# EAGLE design owc-transmitter-ir-v2 (EAGLE 8.6.0)

## Sheet 1 of 3
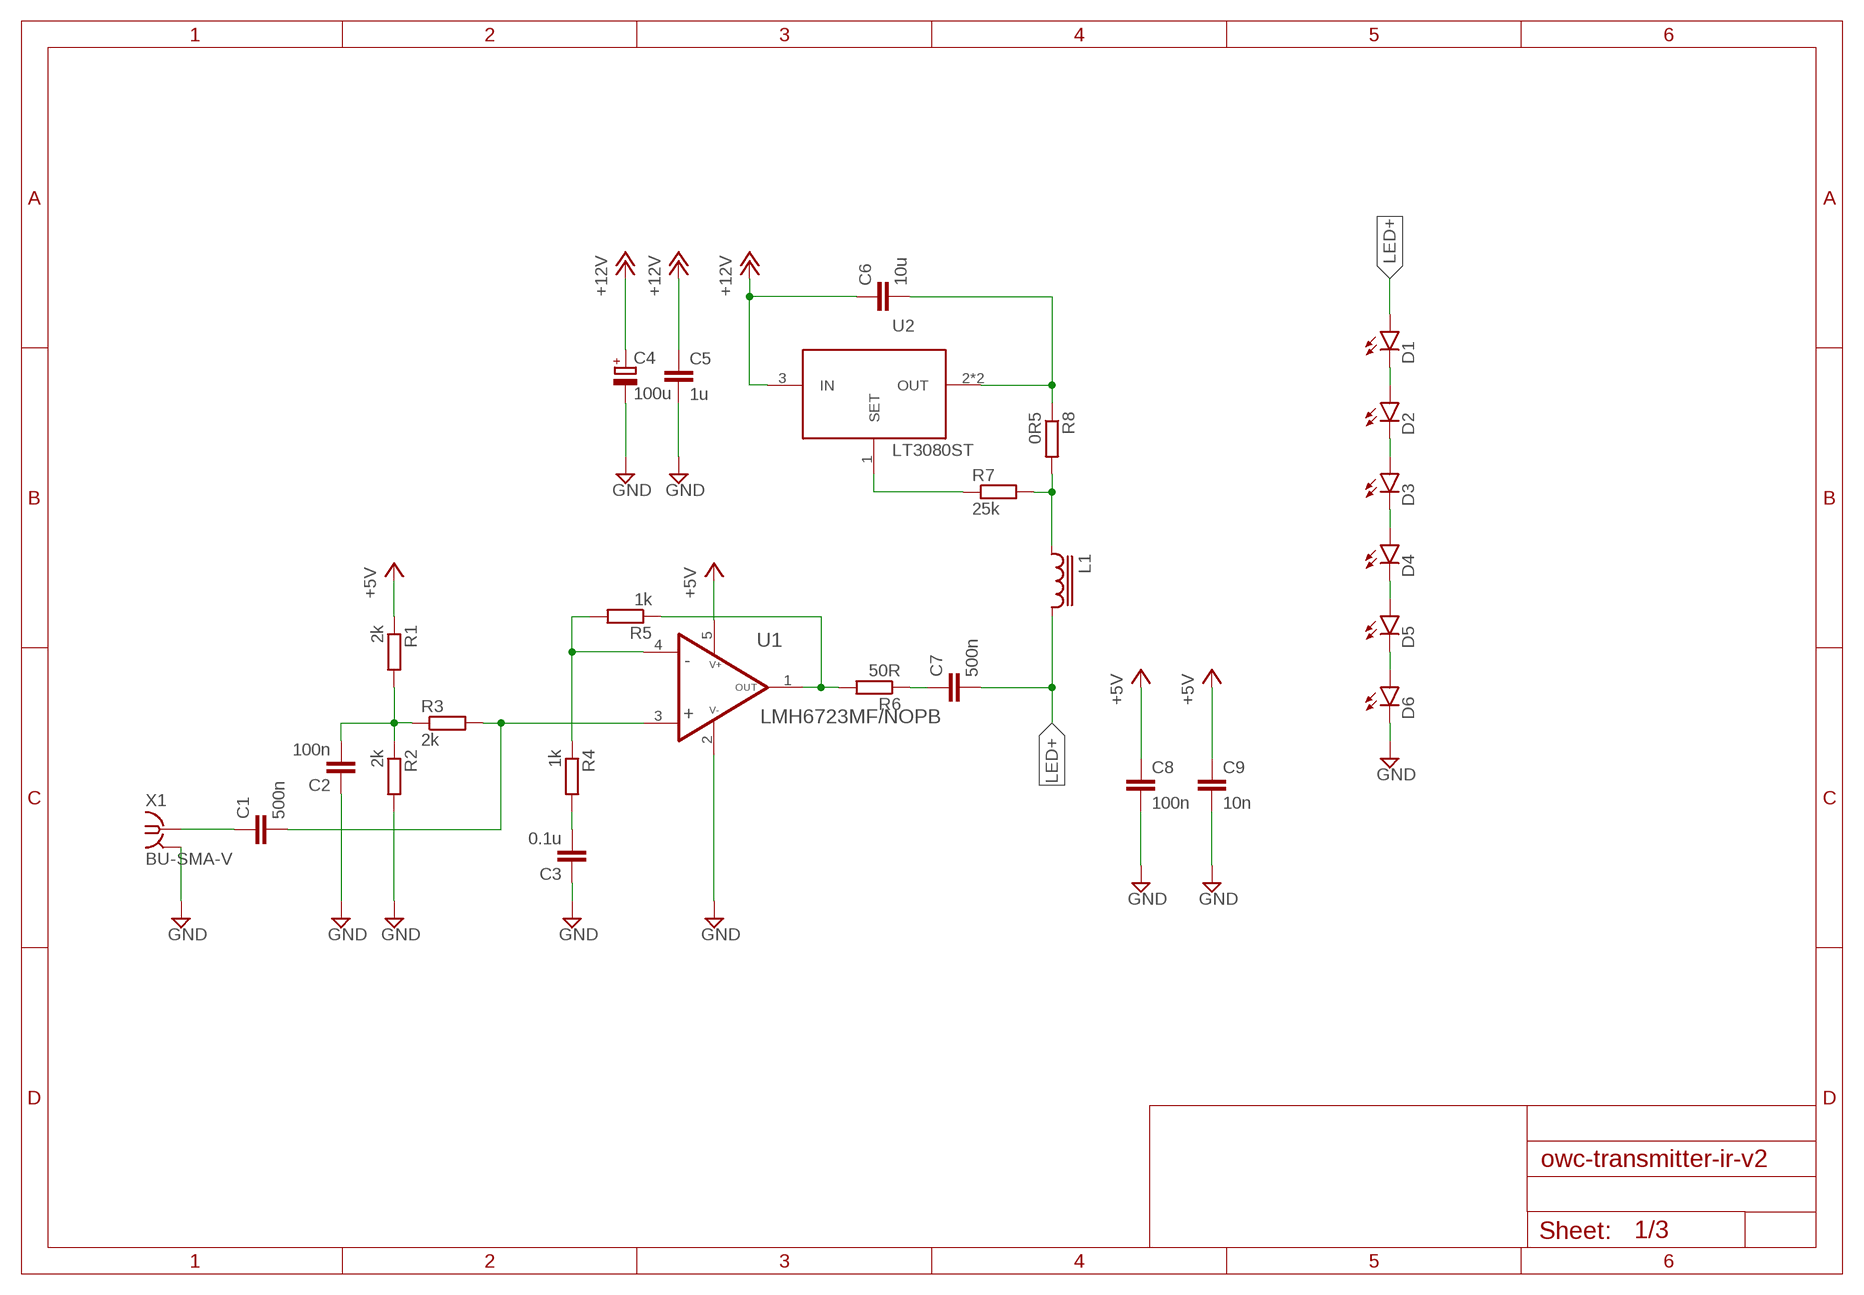
[diagram p0: schematic, sheet 1]

### Parts
C1  500n  C-EUC0805  [C0805]
C2  100n  C-EUC0805  [C0805]
C3  0.1u  C-EUC0805  [C0805]
C4  100u  CPOL-EUCT3528  [CT3528]
C5  1u  C-EUC0805  [C0805]
C6  10u  C-EUC0805  [C0805]
C7  500n  C-EUC0805  [C0805]
C8  100n  C-EUC0805  [C0805]
C9  10n  C-EUC0805  [C0805]
D1  LED5MM  [LED5MM]
D2  LED5MM  [LED5MM]
D3  LED5MM  [LED5MM]
D4  LED5MM  [LED5MM]
D5  LED5MM  [LED5MM]
D6  LED5MM  [LED5MM]
L1  SRR6603  [SRR6603]
R1  2k  R-EU_R0805  [R0805]
R2  2k  R-EU_R0805  [R0805]
R3  2k  R-EU_R0805  [R0805]
R4  1k  R-EU_R0805  [R0805]
R5  1k  R-EU_R0805  [R0805]
R6  50R  R-EU_R0805  [R0805]
R7  25k  R-EU_R0805  [R0805]
R8  0R5  R-EU_R0805  [R0805]
U1  LMH6723MF/NOPB  [SOT23-5L]
U2  LT3080ST  [SOT223]
X1  BU-SMA-V  [BU-SMA-V]

### Nets
+5V: C8.1 C9.1 R1.1 U1.5(V+) ; also sheet 3
+12V: C4.+ C5.1 C6.1 U2.3(IN) ; also sheet 3
GND: C2.1 C3.1 C4.- C5.2 C8.2 C9.2 D6.K(C) R2.2 U1.2(V-) X1.2 X1.3 X1.4 X1.5 ; also sheet 2,3
LED+: C7.2 D1.A L1.P$2
N$1: D1.K(C) D2.A
N$2: D2.K(C) D3.A
N$3: D3.K(C) D4.A
N$4: D4.K(C) D5.A
N$5: D5.K(C) D6.A
N$6: R5.1 R6.2 U1.1(OUT)
N$7: C7.1 R6.1
N$8: R4.1 R5.2 U1.4(IN-)
N$9: C6.2 R8.1 U2.2(OUT) U2.4(OUT)
N$10: C3.2 R4.2
N$11: L1.P$1 R7.2 R8.2
N$12: C2.2 R1.2 R2.1 R3.1
N$13: C1.1 X1.1
N$14: R7.1 U2.1(SET)
N$15: C1.2 R3.2 U1.3(IN+)

## Sheet 2 of 3
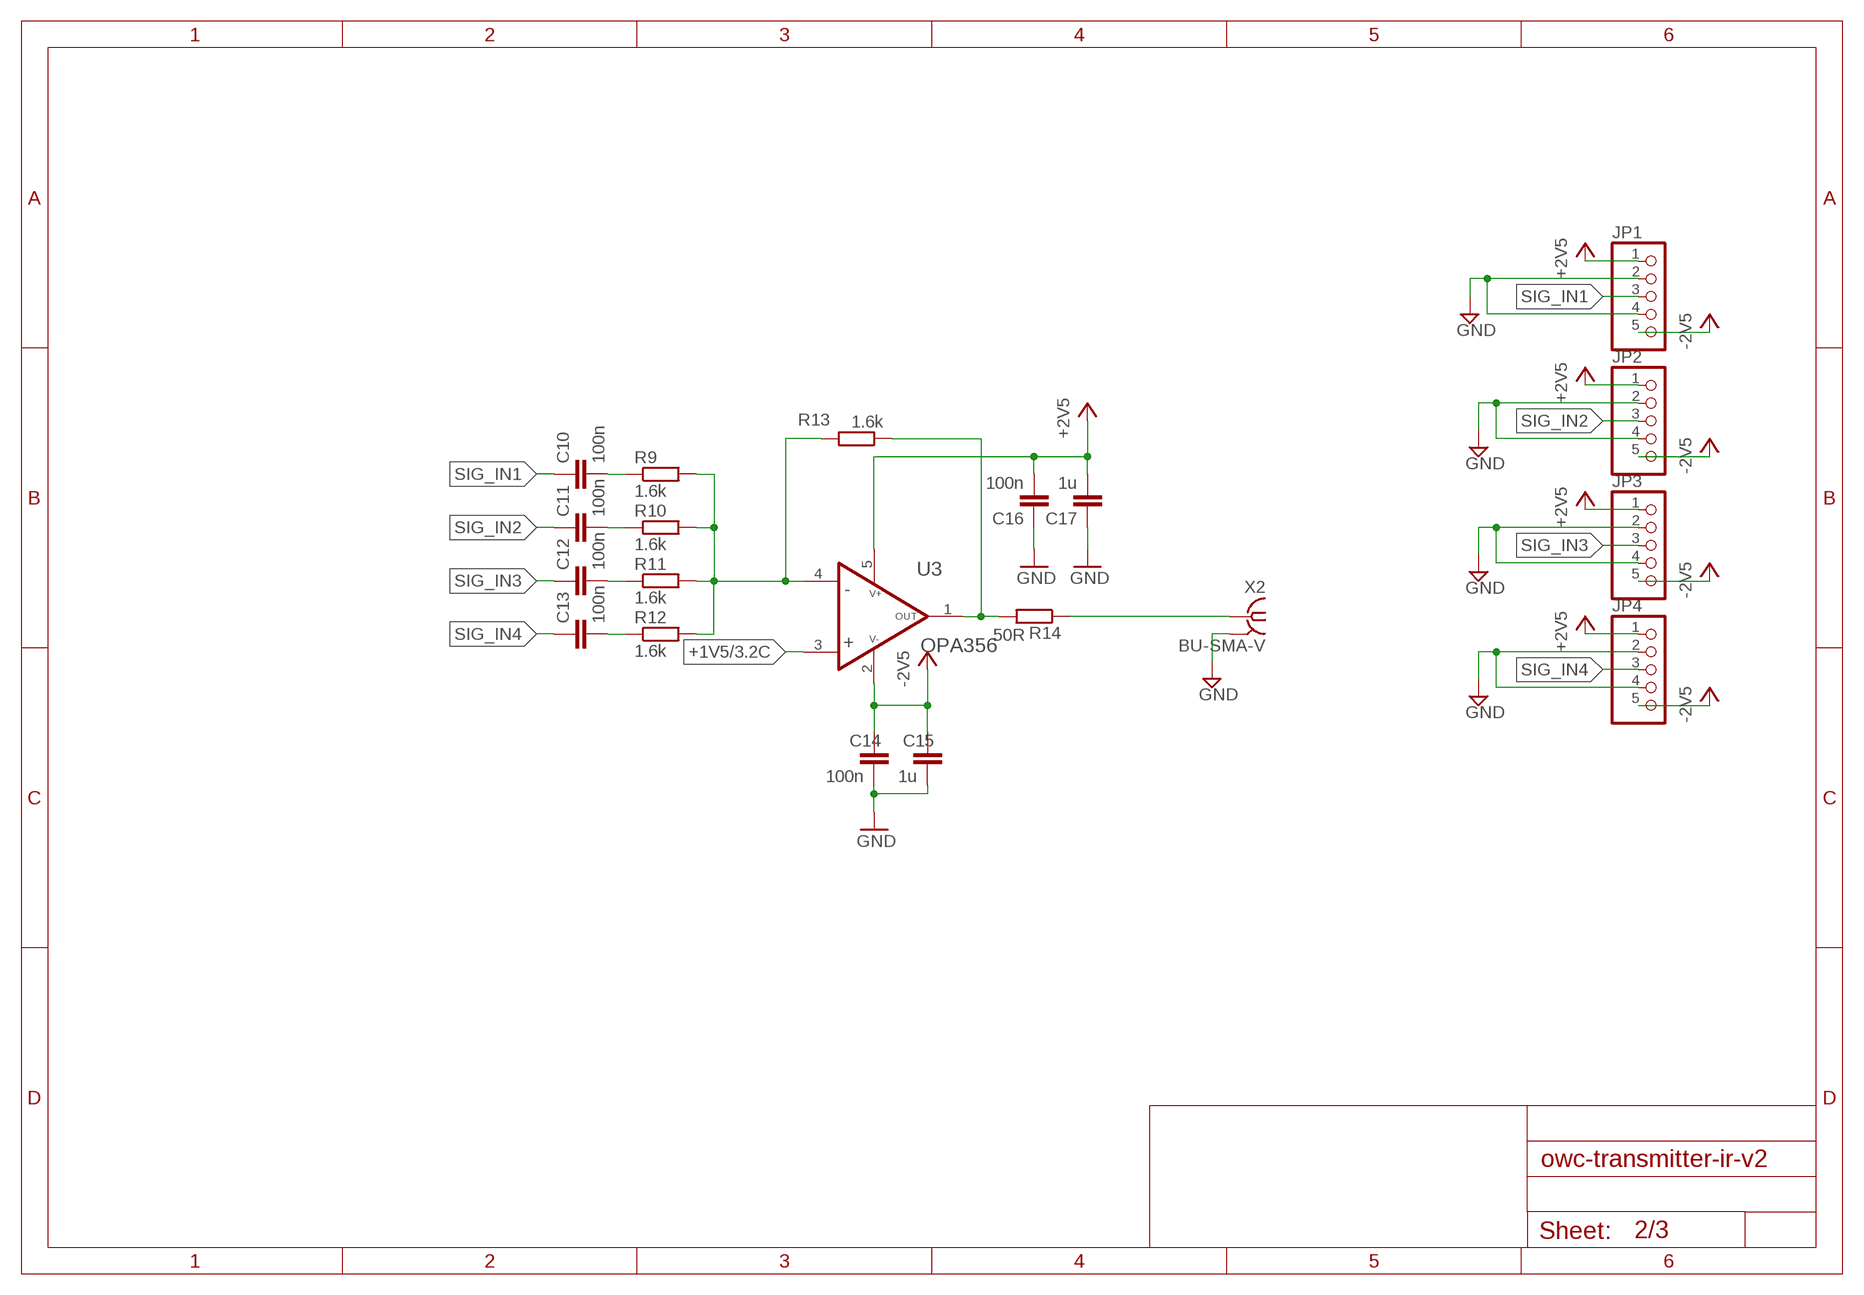
[diagram p1: schematic, sheet 2]

### Parts
C10  100n  C-EUC0805  [C0805]
C11  100n  C-EUC0805  [C0805]
C12  100n  C-EUC0805  [C0805]
C13  100n  C-EUC0805  [C0805]
C14  100n  C-EUC0805  [C0805]
C15  1u  C-EUC0805  [C0805]
C16  100n  C-EUC0805  [C0805]
C17  1u  C-EUC0805  [C0805]
JP1  PINHD-1X5  [1X05]
JP2  PINHD-1X5  [1X05]
JP3  PINHD-1X5  [1X05]
JP4  PINHD-1X5  [1X05]
R9  1.6k  R-EU_R0805  [R0805]
R10  1.6k  R-EU_R0805  [R0805]
R11  1.6k  R-EU_R0805  [R0805]
R12  1.6k  R-EU_R0805  [R0805]
R13  1.6k  R-EU_R0805  [R0805]
R14  50R  R-EU_R0805  [R0805]
U3  OPA356  LMH6629MF  [SOT23-5L]
X2  BU-SMA-V  [BU-SMA-V]

### Nets
+1V5: U3.3(IN+) ; also sheet 3
+2V5: C16.2 C17.2 JP1.1 JP2.1 JP3.1 JP4.1 U3.5(V+) ; also sheet 3
-2V5: C14.1 C15.1 JP1.5 JP2.5 JP3.5 JP4.5 U3.2(V-) ; also sheet 3
GND: C14.2 C15.2 C16.1 C17.1 JP1.2 JP1.4 JP2.2 JP2.4 JP3.2 JP3.4 JP4.2 JP4.4 X2.2 X2.3 X2.4 X2.5 ; also sheet 1,3
N$16: R13.1 R14.2 U3.1(OUT)
N$18: C12.2 R11.1
N$19: R9.2 R10.2 R11.2 R12.2 R13.2 U3.4(IN-)
N$20: R14.1 X2.1
N$22: C11.2 R10.1
N$24: C13.2 R12.1
N$26: C10.2 R9.1
SIG_IN1: C10.1 JP1.3
SIG_IN2: C11.1 JP2.3
SIG_IN3: C12.1 JP3.3
SIG_IN4: C13.1 JP4.3

## Sheet 3 of 3
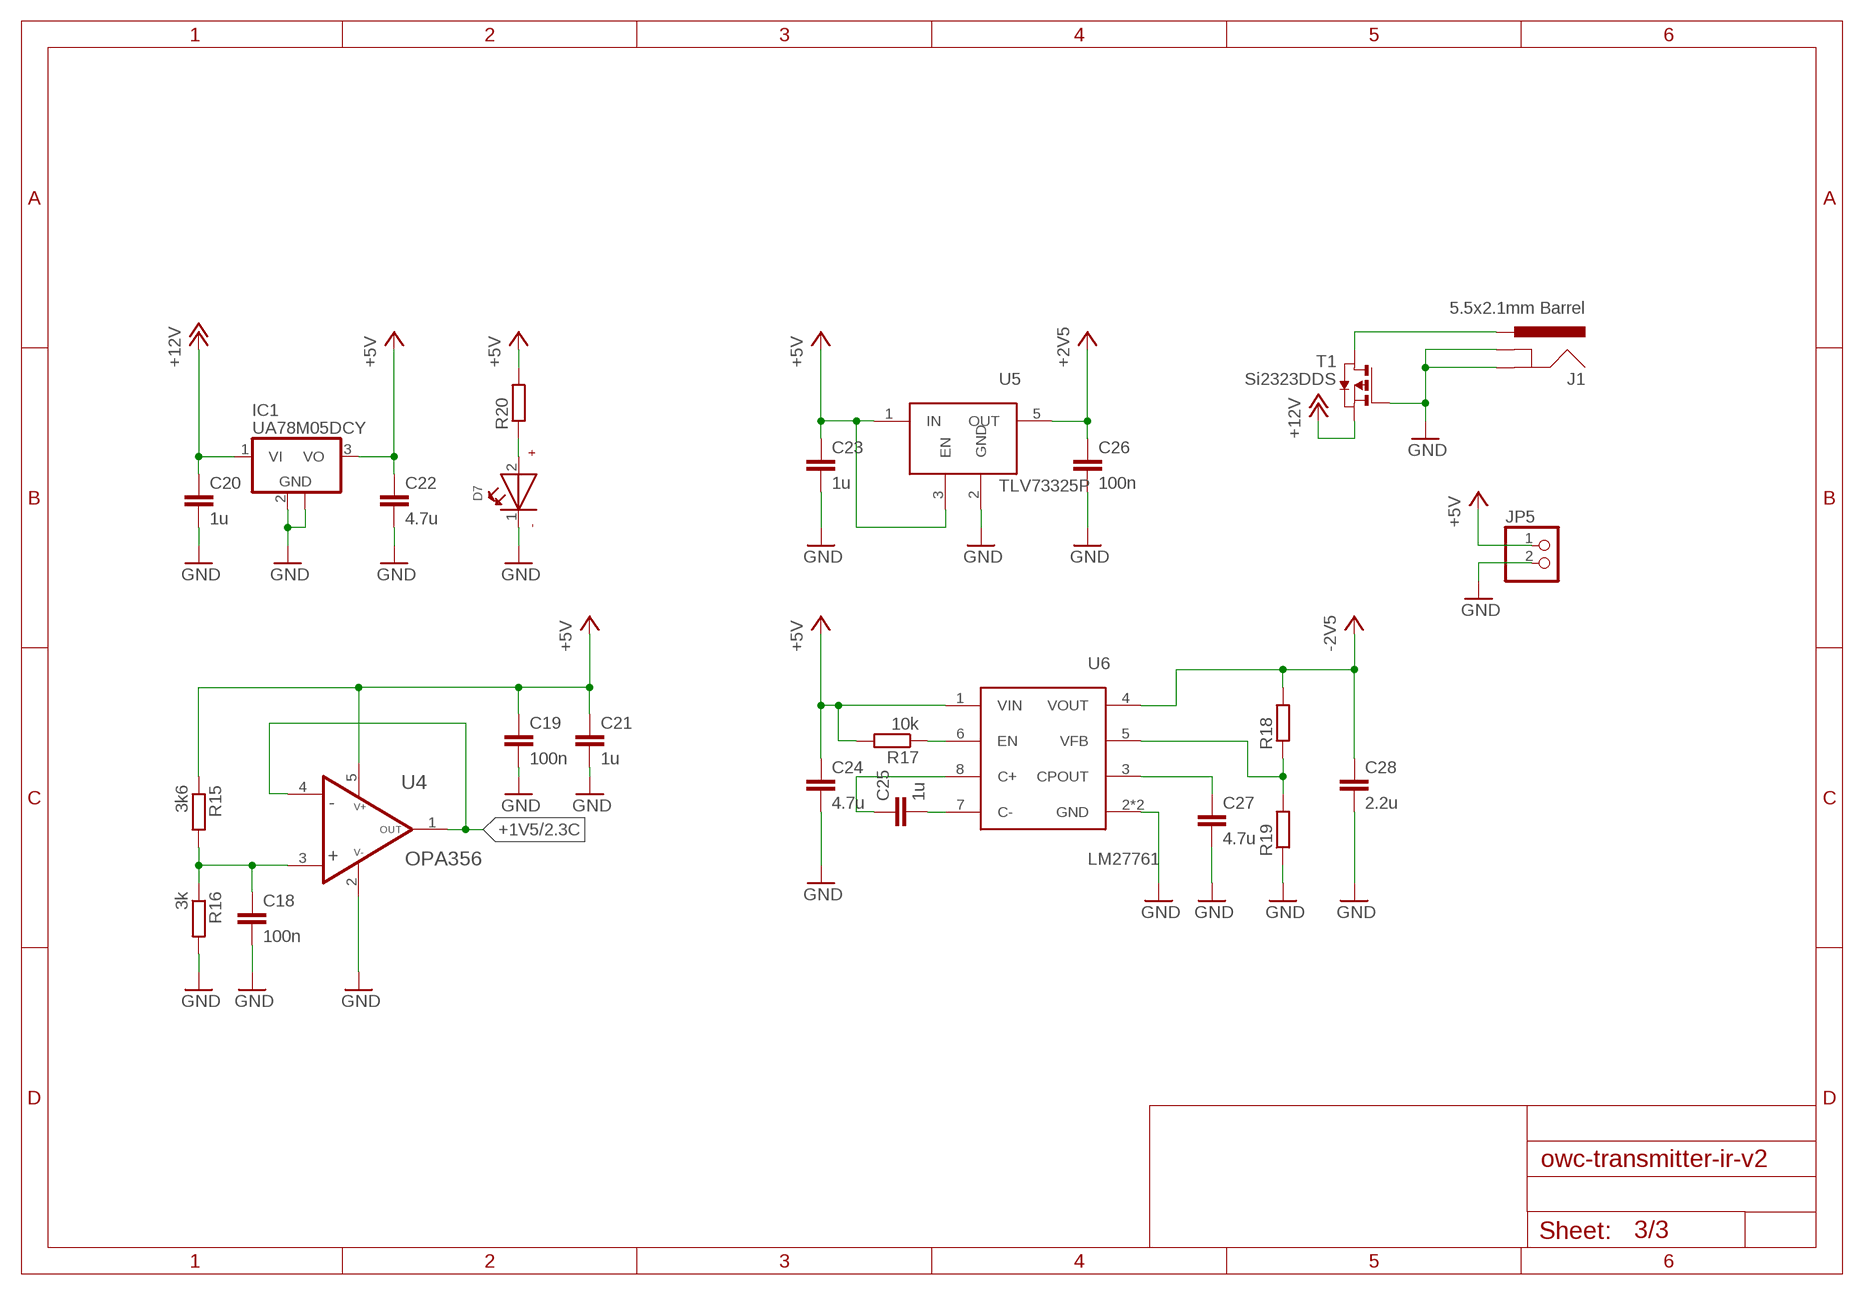
[diagram p2: schematic, sheet 3]

### Parts
C18  100n  C-EUC0805  [C0805]
C19  100n  C-EUC0805  [C0805]
C20  1u  C-EUC0805  [C0805]
C21  1u  C-EUC0805  [C0805]
C22  4.7u  C-EUC0805  [C0805]
C23  1u  C-EUC0805  [C0805]
C24  4.7u  C-EUC0805  [C0805]
C25  1u  C-EUC0805  [C0805]
C26  100n  C-EUC0805  [C0805]
C27  4.7u  C-EUC0805  [C0805]
C28  2.2u  C-EUC0805  [C0805]
D7  WL-SMCW-150080GS75000-G  [WL-SMCW_0805]
IC1  UA78M05DCY  [SOT223]
J1  5.5x2.1mm Barrel  POWER_JACKSMD  [POWER_JACK_SMD]
JP5  PINHD-1X2  [1X02]
R15  3k6  R-EU_R0805  [R0805]
R16  3k  R-EU_R0805  [R0805]
R17  10k  R-EU_R0805  [R0805]
R18  R-EU_R0805  [R0805]
R19  R-EU_R0805  [R0805]
R20  R-EU_R0805  [R0805]
T1  Si2323DDS  PMOSSOT23  [SOT-23]
U4  OPA356  LMH6629MF  [SOT23-5L]
U5  TLV73325P  V_REG5-FIXEDEN  [SOT23-5L]
U6  LM27761DSG  [WSON-8-PAD]

### Nets
+1V5: U4.1(OUT) U4.4(IN-) ; also sheet 2
+2V5: C26.1 U5.5(OUT) ; also sheet 2
+5V: C19.1 C21.1 C22.1 C23.1 C24.1 IC1.3(VO) JP5.1 R15.1 R17.2 R20.2 U4.5(V+) U5.1(IN) U5.3(EN) U6.1(VIN) ; also sheet 1
+12V: C20.1 IC1.1(VI) T1.2(S) ; also sheet 1
-2V5: C28.1 R18.2 U6.4(VOUT) ; also sheet 2
GND: C18.2 C19.2 C20.2 C21.2 C22.2 C23.2 C24.2 C26.2 C27.2 C28.2 D7.1(-) IC1.2(GND) IC1.4(GND) J1.GND(GNDBREAK) J1.P$4(GND) JP5.2 R16.2 R19.1 T1.3(G) U4.2(V-) U5.2(GND) U6.2(GND) U6.PAD(GND) ; also sheet 1,2
N$17: C27.1 U6.3(CPOUT)
N$21: C25.1 U6.8(C+)
N$23: C25.2 U6.7(C-)
N$25: D7.2(+) R20.1
N$27: R17.1 U6.6(EN)
N$28: R18.1 R19.2 U6.5(VFB)
N$29: C18.1 R15.2 R16.1 U4.3(IN+)
N$30: J1.VIN0(PWR) T1.1(D)

## Library data of the parts
C1-C3 C5-C28 = resistor:C-EU: CAPACITOR, European symbol
C4 = rcl:CPOL-EU: POLARIZED CAPACITOR, European symbol; SPICEPREFIX: C
D1-D6 = misc-parts:LED: LEDs Standard schematic elements and footprints for 5mm, 3mm, 1206, and 0603 sized LEDs. 5mm - Spark Fun Electronics SKU : COM-00529 (and others)
D7 = Wurth_Elektronik_Optoelectronics_rev17b:WL-SMCW: SMD mono-color Chip LED Characteristics Low energy consumption High reliability Low current requirement Fast switching No UV/IR radiation Smallest SMD package with exceptional brightness Top view Wide viewing angle PBC high-usage Applications Backlight for mobile and portable device keypads Indoor and outdoor message boards Flat backlight for LCDs, switches and symbols Display for industrial control systems and traffic Miniaturized color effects Pedestrian mark Optical indicators General lighting Toys <http://katalog.we-online.de/media/images/eipal/WL-SMCW_pf2.jpg> Details see: http://katalog.we-online.de/en/led/WL-SMCW?m Updated 2015-04-10 2015 (C) Wurth Elektronik
IC1 = linear:UA78M*: POSITIVE-VOLTAGE REGULATORS Source: http://focus.ti.com/lit/ds/symlink/ua78m33.pdf
J1 = SparkFun-Connectors:POWER_JACK: Power Jack This is the standard 5.5mm barrel jack for power. The PTH is the most common, proven, reliable, footprint. The Slot footprint only works if the mill layer is transmitted to the PCB fab house so be warned. Mating wall wart : TOL-00298 (and others); PROD_ID: CONN-08106; SF_ID: PRT-12748
JP1-JP4 = pinhead+:PINHD-1X5: PIN HEADER
JP5 = pinhead+:PINHD-1X2: PIN HEADER
L1 = misc-parts:SRR6603
R1-R20 = resistor:R-EU_: RESISTOR, European symbol
T1 = zetex:PMOSSOT23: MOS FET; OC_FARNELL: unknown; OC_NEWARK: unknown
U1 = misc-parts:LMH6723
U2 = misc-parts:LT3080
U3 U4 = misc-parts:LMH6629
U5 = misc-parts:V_REG5-FIXED
U6 = misc-parts:LM27761; MPN: LM27761DSGT
X1 X2 = con-coax:BU-SMA-V: FEMALE SMA CONNECTOR Radiall distributor RS 112-3794; OC_FARNELL: unknown; OC_NEWARK: unknown

## Board
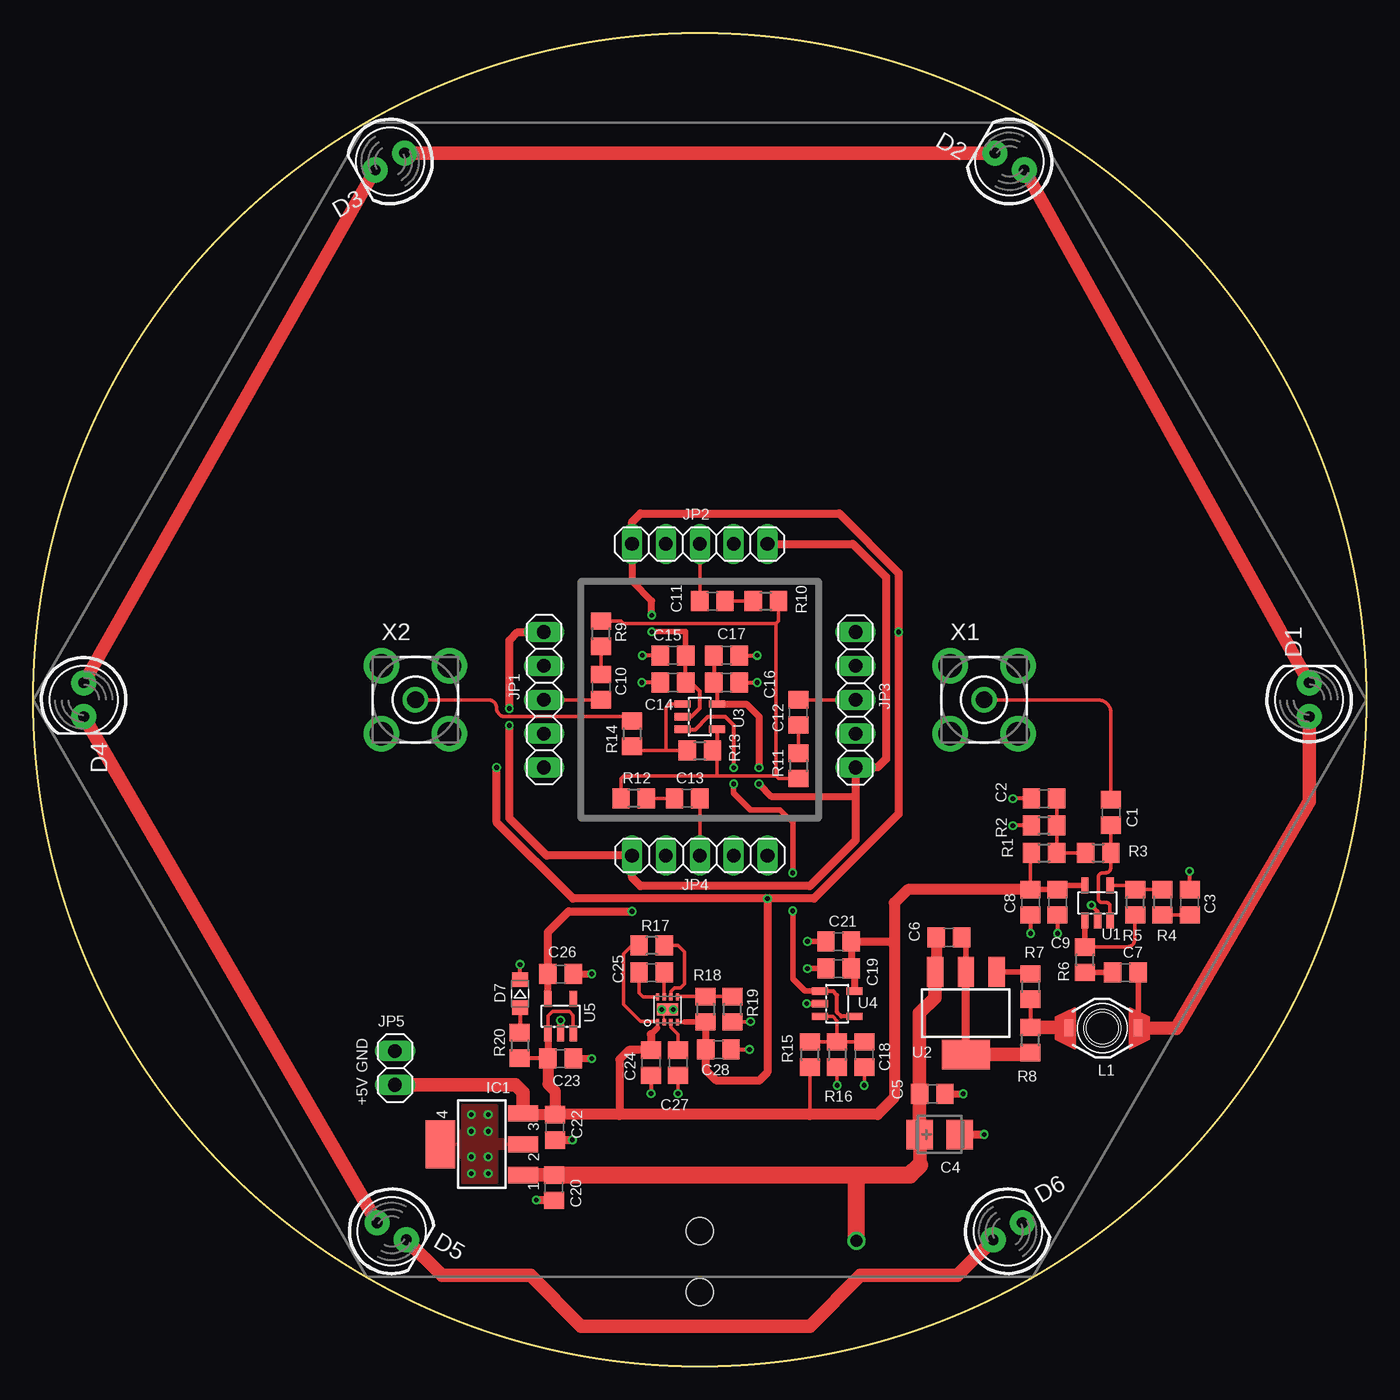
[diagram p3: board, top side]
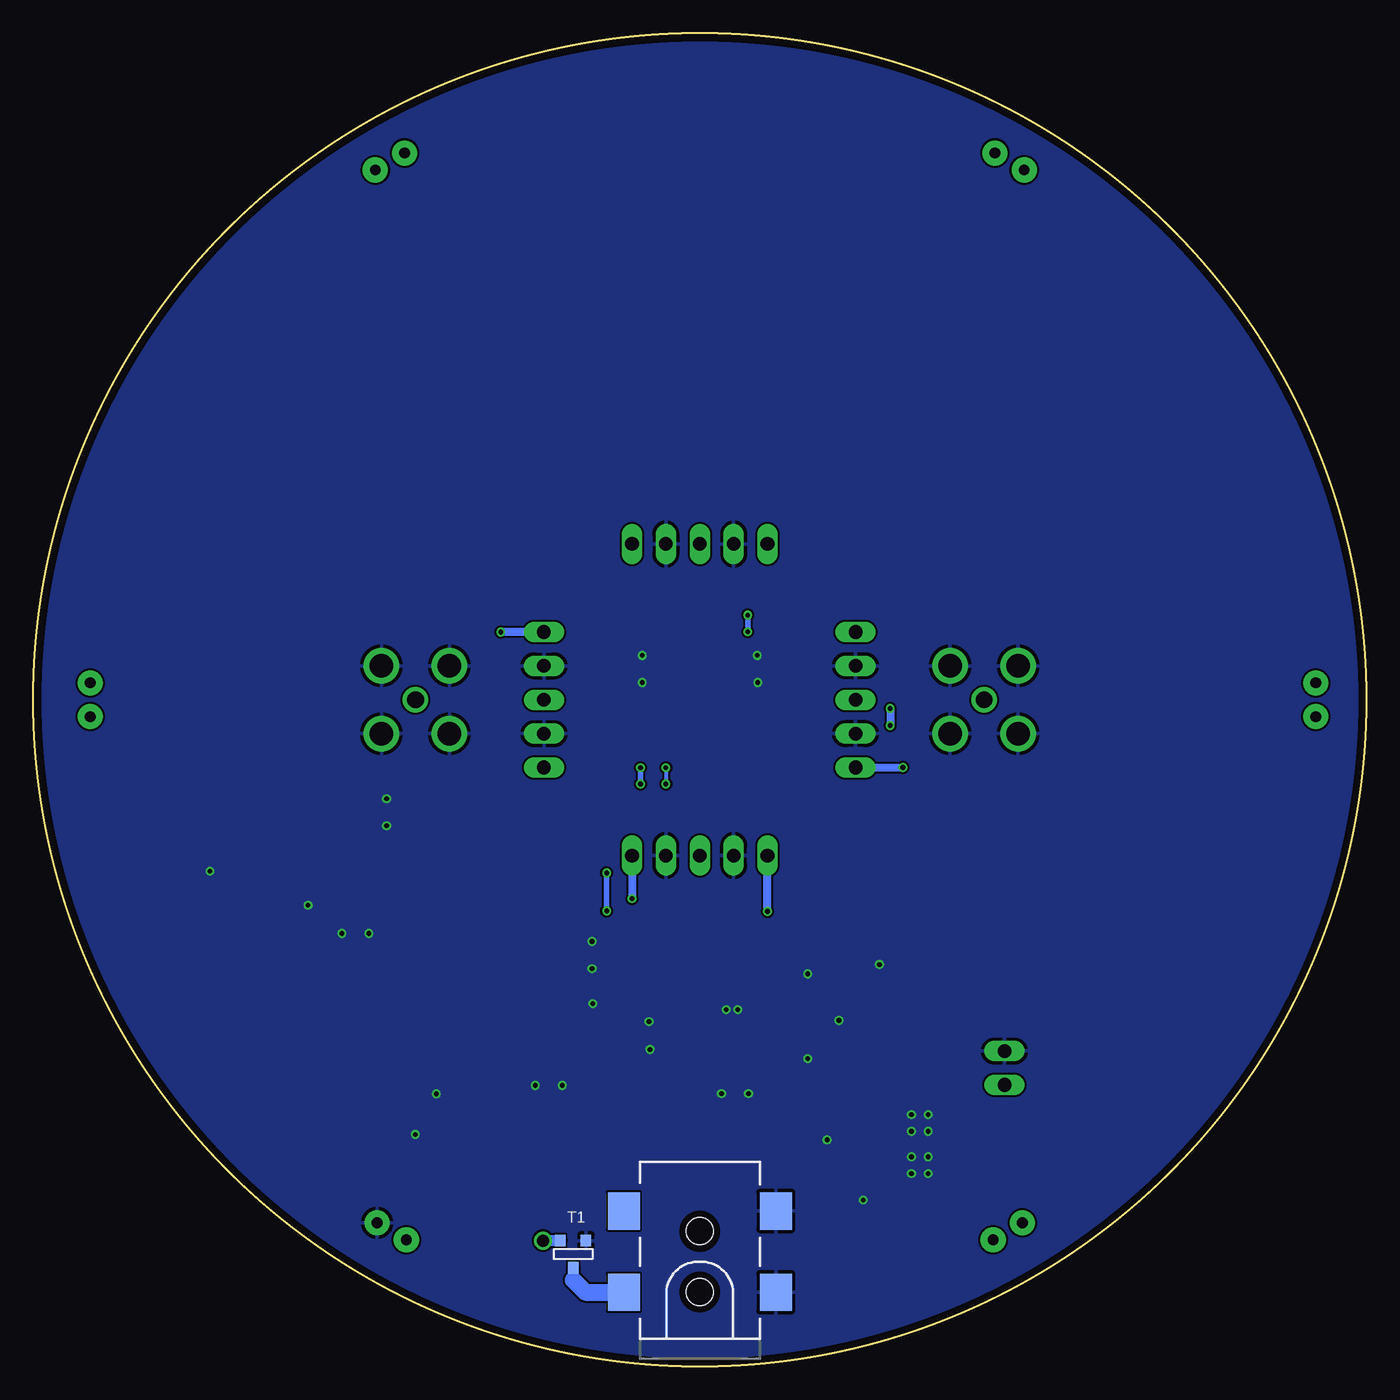
[diagram p4: board, bottom side, seen from below]

Size 100 x 100 mm. Coordinates in mm from the lower left corner, seen from the top.
Outline: circle at 50,50 radius 50
Copper layers (1*16): Top 0.035mm / dielectric 1.6mm / Bottom 0.035mm
Design rules "Elecrow-2-layer_PCB_eagle_rule *": minimum track width 6mil, minimum drill 12mil, track to track 6mil, track to pad 8mil, pad to pad 8mil, via to via 12mil, smd to smd 0mil, copper to edge 20mil, drill to drill 10mil, minimum pad ring 6mil, minimum via ring 6mil, stop-mask expansion 0.2mm, vias tented up to drill 100mil, thermal gap 10mil

### Footprints (pad centres in the part's own frame; a part is rotated, then mirrored left to right if it is on the bottom)
C0805 = smd 1.3 x 1.5: 1 -0.95,0; 2 0.95,0
CT3528 = smd 2 x 2.2: + -1.5,0; - 1.5,0
LED5MM = drill 0.813 pad 1.88: A -1.27,0; K 1.27,0
WL-SMCW_0805 = smd 1.1 x 1.2: 1 -1.05,0; 2 1.05,0
SOT223 = smd 1.219 x 2.235: 1 -2.311,-3.099; 2 0,-3.099; 3 2.311,-3.099 | smd 3.6 x 2.2: 4 0,3.099
POWER_JACK_SMD = smd 2.8 x 2.4: GND 0,-5.7; P$4 6.1,-5.7; VIN0 0,5.7; VIN1 6.1,5.7 | hole 2.032: 0,0; 4.572,0
1X05 = drill 1.016 long: 1 -5.08,0; 2 -2.54,0; 3 0,0; 4 2.54,0; 5 5.08,0
1X02 = drill 1.016 long: 1 -1.27,0; 2 1.27,0
SRR6603 = smd 0.635 x 1.27: P$1 -2.515,0.04; P$2 2.7,0.01
R0805 = smd 1.3 x 1.5: 1 -0.95,0; 2 0.95,0
SOT-23 = smd 0.787 x 0.889: 1 0.025,-1.016; 2 -0.94,1.016; 3 0.991,1.016
SOT23-5L = smd 0.55 x 1.2: 1 -0.95,-1.3; 2 0,-1.3; 3 0.95,-1.3; 4 0.95,1.3; 5 -0.95,1.3
WSON-8-PAD = smd 0.25 x 0.5: 1 -0.75,-0.95; 2 -0.25,-0.95; 3 0.25,-0.95; 4 0.75,-0.95; 5 0.75,0.95; 6 0.25,0.95; 7 -0.25,0.95; 8 -0.75,0.95 | smd 1.6 x 0.9: PAD 0,0
BU-SMA-V = drill 1.27: 1 0,0 | drill 1.778: 2 -2.55,2.55; 3 2.55,2.55; 4 2.55,-2.55; 5 -2.55,-2.55

### Placement (x,y rotation side)
C1  80.86,41.54 270 top
C2  75.83,42.58 0 top
C3  86.75,34.81 270 top
C4  68.01,17.39 0 top
C5  67.45,20.43 0 top
C6  68.69,32.17 0 top
C7  81.93,29.53 0 top
C8  74.82,34.81 270 top
C9  76.85,34.81 270 top
C10  42.61,50.94 90 top
C11  50.94,57.39 0 top
C12  57.39,49.06 270 top
C13  49.06,42.61 180 top
C14  47.99,51.3 180 top
C15  47.99,53.33 180 top
C16  52.01,51.3 180 top
C17  52.01,53.33 180 top
C18  62.34,23.38 270 top
C19  60.41,29.83 180 top
C20  39.05,13.4 270 top
C21  60.41,31.86 180 top
C22  39.13,17.92 270 top
C23  39.56,23.08 0 top
C24  46.34,22.77 270 top
C25  46.39,29.53 0 top
C26  39.56,29.43 0 top
C27  48.37,22.77 270 top
C28  51.4,23.76 0 top
D1  95.72,50 90 top
D2  73.24,90.39 150 top
D3  26.76,90.39 210 top
D4  3.77,50 270 top
D5  26.89,10.12 330 top
D6  73.11,10.12 30 top
D7  36.51,27.94 270 top
IC1  33.64,16.65 90 top
J1  50,5.55 90 bottom
JP1  38.32,50 270 top
JP2  50,61.68 180 top
JP3  61.68,50 90 top
JP4  50,38.32 0 top
JP5  27.14,22.38 90 top
L1  80.2,25.36 0 top
R1  75.83,38.52 0 top
R2  75.83,40.55 180 top
R3  79.9,38.52 0 top
R4  84.72,34.81 270 top
R5  82.69,34.81 90 top
R6  78.91,30.49 90 top
R7  74.82,28.49 270 top
R8  74.82,24.47 90 top
R9  42.61,54.95 90 top
R10  54.95,57.39 0 top
R11  57.39,45.05 270 top
R12  45.05,42.61 180 top
R13  50,46.19 0 top
R14  44.92,47.46 270 top
R15  58.28,23.38 90 top
R16  60.31,23.38 270 top
R17  46.39,31.56 180 top
R18  50.43,26.78 270 top
R19  52.46,26.78 90 top
R20  36.5,24.07 270 top
T1  59.52,8.41 0 bottom
U1  79.84,34.76 0 top
U2  69.96,26.48 180 top
U3  50,48.73 270 top
U4  60.31,27.19 270 top
U5  39.56,26.25 0 top
U6  47.59,26.76 0 top
X1  71.34,50 0 top
X2  28.66,50 0 top

### Tracks (layer width: path | path; a pad name or v marks a point on that pad's centre or on a via)
+1V5  (via drill 0.35)
  Top 0.305: U3.3 49.69,47.78 50.63,48.73 51.91,48.73 52.54,48.09 v52.54,44.89 | U4.1 60,28.14 60.31,27.83 60.31,26.56 60.63,26.24 U4.4
  Top 0.406: v52.54,43.67 52.54,43.02 53.81,41.74 56.03,41.74 56.98,40.79 v56.98,37.01 | U4.1 57.89,28.14 56.98,29.05 v56.98,34.15
  Bottom 0.305: v52.54,44.89 v52.54,43.67
  Bottom 0.406: v56.98,34.15 v56.98,37.01
+2V5  (via drill 0.35)
  Top 0.305: C17.2 C16.2 51.3,51.05 U3.5
  Top 0.508: U5.5 C26.1 | U3.5 53.49,49.68 54.45,48.73 v54.45,44.89 | v54.45,43.67 55.36,42.76 61.62,42.76 61.68,42.7
  Top 0.61: JP2.1 61.49,61.68 63.97,59.21 63.97,45.55 63.34,44.92 JP3.1 61.68,42.7 61.68,39.46 58.26,36.03 45.55,36.03 44.92,36.66 JP4.1 38.51,38.32 35.71,41.11 v35.71,48.07 | v35.71,49.34 35.71,54.45 36.35,55.08 JP1.1 | C26.1 38.61,32.58 40.16,34.12 v44.92,34.12
  Bottom 0.406: v54.45,44.89 v54.45,43.67
  Bottom 0.61: v35.71,49.34 v35.71,48.07 | v44.92,34.12 JP4.1
+5V
  Top 0.203: 46.82,25.79 U6.1
  Top 0.254: R1.1 74.89,38.51 arc90 74.82,38.43 C8.1 | U6.1 46.84,25.58 | U6.1 46.84,25.4 | 58.26,22.41 58.26,18.89 | U6.1 46.78,25.87 45.55,25.87 44.28,27.14 44.28,30.95 44.92,31.59 44.95,31.56 R17.2 | U5.1 38.61,26.27 38.95,26.61 40.22,26.61 40.5,26.33 U5.3
  Top 0.305: 76.85,36.06 C9.1 | C23.1 36.54,23.08
  Top 0.406: C8.1 C9.1 | U1.5 76.85,36.06 | 46.84,25.4 46.34,24.91 | 36.54,23.08 R20.2
  Top 0.508: R1.1 74.83,38.57 | U5.1 38.62,24.95 38.62,23.08 | C21.1 C19.1 | 61.61,29.58 U4.5
  Top 0.61: 46.34,24.91 C24.1 44.68,23.72 43.97,23.01 43.97,18.89 | C23.1 38.62,23.08 | C19.1 61.61,29.58 | C21.1 64.33,31.86 64.61,31.59
  Top 0.813: 39.14,18.89 43.97,18.89 58.26,18.89 63.34,18.89 64.61,20.16 64.61,31.59 64.61,34.76 65.61,35.76 C8.1 | R15.1 58.26,22.41 | 39.14,18.89 C22.1 36.83,18.87 | C23.1 38.61,21.16 39.14,20.62 39.14,18.89
  Top 1.016: JP5.1 36.17,21.11 36.74,20.54 IC1.3 36.83,18.87
+12V  (via drill 0.9)
  Top 0.61: 67.74,29.67 U2.3
  Top 0.813: C6.1 67.74,29.67
  Top 1.016: U2.3 67.65,27.65 66.5,26.5 C5.1 C4.+ 66.51,15.08 | IC1.1 39.04,14.34 C20.1 | v61.76,9.42 61.75,9.44
  Top 1.27: C20.1 61.75,14.35 | 61.75,14.35 65.78,14.35 66.51,15.08 | 61.75,9.44 61.75,14.35
  Bottom 0.813: T1.2 v61.76,9.42
-2V5  (via drill 0.35)
  Top 0.254: 50.41,25.81 R18.2 | 50.43,23.78 C28.1 | U6.4 48.86,25.81 48.86,25.82
  Top 0.305: C14.1 48.94,51.06 | C14.1 C15.1 | U3.2 49.37,48.73 50,49.37 50,50.63 49.34,51.3 C14.1
  Top 0.406: 46.38,55.09 v46.39,55.11 48.94,55.11 C15.1 | R18.2 48.86,25.83 48.86,25.82
  Top 0.508: R18.2 50.43,23.78 | v46.39,56.35 46.39,57.42 44.92,58.89 JP2.5
  Top 0.61: C28.1 50.45,22.25 51.27,21.43 54.45,21.43 55.08,22.06 v55.08,35.08 | JP2.5 44.92,63.34 45.55,63.97 60.48,63.97 64.92,59.52 v64.92,55.08 64.92,41.43 58.57,35.08 v55.08,35.08 | v55.08,35.08 40.48,35.08 34.76,40.79 v34.76,44.92
  Bottom 0.406: v46.39,56.35 v46.39,55.11
  Bottom 0.61: JP3.5 v64.92,55.08 | JP4.5 v55.08,35.08 | JP1.5 v34.76,44.92
GND  (via drill 0.35)
  Top 0.152: U6.2 47.34,26.51 U6.PAD v48.02,26.76
  Top 0.254: v48.37,20.46 C27.2 | R19.1 v53.81,25.83 v53.81,25.84 | R16.2 v60.31,21.07 | C18.2 v62.34,21.07
  Top 0.305: C2.1 v73.5,42.58 | R2.2 v73.5,40.55 | C3.1 v86.75,37.15 | C8.2 v74.82,32.47 | C9.2 v76.85,32.47 | v79.39,34.58 79.84,34.12 U1.2 | C15.2 v45.68,53.33 | C14.2 v45.66,51.3 | C17.1 v54.32,53.33 | C16.1 v54.32,51.3 | C24.2 v46.34,20.46 | C28.2 v53.73,23.76 | D7.1 v36.51,30.14
  Top 0.406: C21.2 v58.08,31.86 | C19.2 v58.08,29.83 | U4.2 v58.03,27.19
  Top 0.508: v39.56,25.95 U5.2 | C26.2 v41.9,29.43 | C23.2 v41.9,23.08 | C5.2 v69.76,20.43
  Top 0.61: C4.- v71.34,17.39 | C20.2 37.74,12.45 v37.73,12.46 | C22.2 v40.44,16.97 v40.45,16.98
  other vias: 47.16,26.76 32.86,14.44 32.86,15.71 32.86,17.62 32.86,18.89 34.12,18.89 34.12,17.62 34.12,15.71 34.12,14.44
  pour Bottom (rank 2): 15,85 arc-180 85,15 arc-180
  pour Top: 32.22,13.8 32.22,15.71 30.32,15.71 30.32,17.62 32.22,17.62 32.22,19.52 34.76,19.52 34.76,16.98 36.66,16.98 36.66,16.34 34.76,16.34 34.76,13.8
LED+
  Top 0.406: C7.2 arc-90 82.9,29.5 L1.P$2
  Top 1.016: L1.P$2 85.76,25.36 95.72,42.38 D1.A
N$1
  Top 1.016: D2.A D1.K
N$2
  Top 1.016: D2.K D3.A
N$3
  Top 1.016: D4.A D3.K
N$4
  Top 1.016: D5.A D4.K
N$5
  Top 1.016: 28.11,9.36 D5.K 30.65,6.82 37.3,6.82 41.11,3.01 58.26,3.01 62.06,6.82 69.35,6.82 D6.A
N$6
  Top 0.254: R6.2 78.89,31.45 82.05,31.45 arc90 82.64,32.04 82.64,33.81 arc-90 R5.1
  Top 0.406: U1.1 78.89,31.45
N$7
  Top 0.254: 80.96,29.54 C7.1
  Top 0.406: R6.1 80.96,29.54
N$8
  Top 0.254: R4.1 R5.2 arc90 82.39,36.06 U1.4
N$9
  Top 0.406: C6.2 arc-90 69.96,31.85 U2.2
  Top 0.61: 74.67,23.38 R8.1 | U2.4 U2.2
  Top 1.016: U2.4 74.67,23.38
N$10
  Top 0.254: C3.2 R4.2
N$11
  Top 0.305: R7.2 R8.2
  Top 0.61: 77.66,25.42 L1.P$1
  Top 1.016: R8.2 77.66,25.42
N$12
  Top 0.254: R3.1 R1.2 R2.1 C2.2
N$13
  Top 0.254: X1.1 79.84,50 arc-90 80.86,48.98 C1.1
N$14
  Top 0.406: R7.1 arc90 74.67,29.58 U2.1
N$15
  Top 0.254: U1.3 arc-90 U1.3 80.78,34.51 arc90 80.5,34.78 80.2,34.78 arc-90 79.9,35.09 79.9,36.66 arc-90 80.25,37.02 80.45,37.02 arc90 80.84,37.4 80.84,38.51 arc-90 R3.2 80.85,40.58 arc-90 C1.2
N$16
  Top 0.254: R13.1 47.46,46.19 | 47.46,46.19 44.92,46.19 R14.2 | U3.1 47.77,49.68 47.46,49.37 47.46,46.19
N$17
  Top 0.254: U6.3 47.84,25.42 48.37,24.88 C27.1
N$18
  Top 0.254: C12.2 R11.1
N$19
  Top 0.254: 55.72,55.72 44.28,55.72 44.1,55.9 R9.2 | R10.2 55.9,55.9 55.72,55.72 | 51.3,44.28 55.72,44.28 | 55.72,55.72 55.72,44.28 | R12.2 44.1,44.1 44.28,44.28 51.27,44.28 51.3,44.28 | R11.2 55.9,44.1 55.72,44.28 | 51.3,46.54 51.3,44.28
  Top 0.305: U3.4 51.3,46.54 R13.2
N$20
  Top 0.254: X2.1 34.12,50 arc-90 34.76,49.37 arc90 35.39,48.73 44.92,48.73 R14.1
N$21
  Top 0.254: U6.8 45.75,27.71 45.45,28 45.45,29.52 C25.1
N$22
  Top 0.254: C11.2 R10.1
N$23
  Top 0.254: U6.7 C25.2
N$24
  Top 0.254: C13.2 R12.1
N$25
  Top 0.305: D7.2 36.51,25.03 R20.1
N$26
  Top 0.254: C10.2 R9.1
N$27
  Top 0.254: U6.6 47.84,28.13 48.09,28.39 48.55,28.39 48.86,28.69 48.86,31.08 48.37,31.56 R17.1
N$28
  Top 0.254: R19.2 R18.1 48.36,27.73 U6.5
N$29
  Top 0.254: R15.2 R16.1 | R16.1 C18.1 | U4.3 59.99,26.24 60.31,25.92 R16.1
N$30
  Bottom 0.813: J1.VIN0 55.73,5.58 55.75,5.55 | T1.1 59.5,6.48
  Bottom 1.27: 59.5,6.48 58.57,5.55 55.75,5.55
SIG_IN1
  Top 0.254: JP1.3 42.6,50 C10.1
SIG_IN2
  Top 0.254: C11.1 50,57.4 JP2.3
SIG_IN3
  Top 0.254: C12.1 57.4,50 JP3.3
SIG_IN4
  Top 0.254: JP4.3 50,42.6 C13.1

### Text on the board
tNames: +5V GND